# Altium schematic sheet Sheet1.SchDoc
size A; SheetNumber: 1; SheetTotal: 1
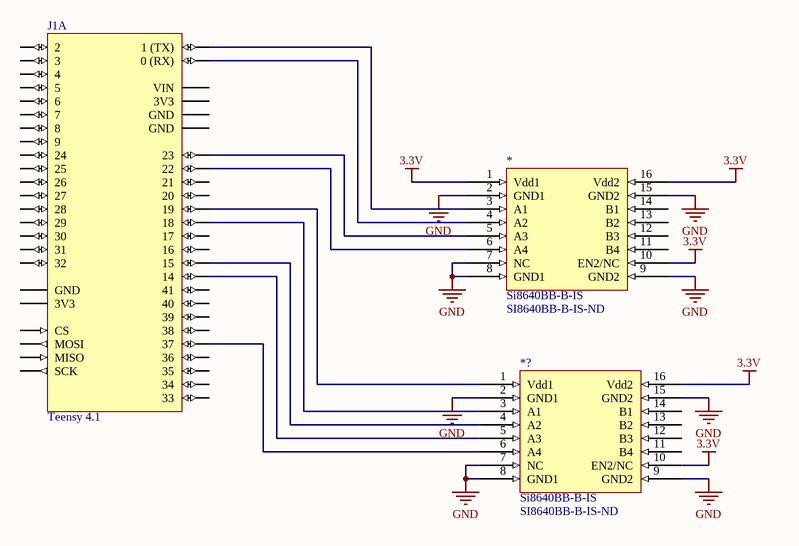
[diagram p0: Sheet1.SchDoc]

## Parts
*  Si8640BB-B-IS  Supplier Part Number 1: SI8640BB-B-IS-ND
*?  Si8640BB-B-IS  Supplier Part Number 1: SI8640BB-B-IS-ND
J1  Teensy 4.1  [Teensy4.1]  (part A of 2)

## Nets
3.3V: *.1(Vdd1) *.10(EN2/NC) *.16(Vdd2) *?.10(EN2/NC) *?.16(Vdd2)
GND: *.2(GND1) *.7(NC) *.8(GND1) *.9(GND2) *.15(GND2) *?.2(GND1) *?.7(NC) *?.8(GND1) *?.9(GND2) *?.15(GND2)
Net*?_1: *?.1(Vdd1) J1.41(19)
Net*?_3: *?.3(A1) J1.40(18)
Net*?_4: *?.4(A2) J1.37(15)
Net*?_5: *?.5(A3) J1.36(14)
Net*?_6: *?.6(A4) J1.29(37)
Net*_3: *.3(A1) J1.3(1_(TX))
Net*_4: *.4(A2) J1.2(0_(RX))
Net*_5: *.5(A3) J1.45(23)
Net*_6: *.6(A4) J1.44(22)

Not connected (* = marked no-connect by the designer): * 11(B4) 12(B3) 13(B2) 14(B1); *? 11(B4) 12(B3) 13(B2) 14(B1); J1 1(GND) 4(2) 5(3) 6(4) 7(5) 8(6) 9(7) 10(8) 11(9) 12(CS) 13(MOSI) 14(MISO) 15(3V3) 16(24) 17(25) 18(26) 19(27) 20(28) 21(29) 22(30) 23(31) 24(32) 25(33) 26(34) 27(35) 28(36) 30(38) 31(39) 32(40) 33(41) 34(GND) 35(SCK) 38(16) 39(17) 42(20) 43(21) 46(3V3) 47(GND) 48(VIN)

## Library data of the parts
* *? = Si8640BB-B-IS: SILICON LABS         SI8640BB-B-IS             Digital Isolator, 4 Channel, 8 ns, 2.5 V, 5.5 V, WSOIC, 16 Pins; Propagation Delay: 13ns; Min Supply Voltage: 2.7V; Max Supply Voltage: 5.5V; Max Power Dissipation: 275mW; Number of Channels: 4; Data Rate: 150Mbps; Isolated Power: No; Pulse Width Distortion (PWD): 4.5ns; Operating Supply Current: 3.6mA; Channel Type: Unidirectional; Max Input Current: 9.2mA; Isolation Voltage: 2.5kV; Rise Time: 4ns; Supplier 1: Digi-Key; Manufacturer: Silicon Labs; Manufacturer Part Number: Si8640BB-B-IS; RoHS: Yes; Category: Integrated Circuits (ICs); Stock 1: 171; Pricing 1: 1=1.84000, 25=1.77440, 100=1.70630, 1000=1.67241 (USD); Mount: Surface Mount; Case/Package: SOIC; Number of Pins: 16; Min Operating Temperature: -40°C; Max Operating Temperature: 125°C; Packaging: Rail/Tube; Package Quantity: 46; Type: General Purpose; Polarity: Unidirectional; Length: 9.9mm; Width: 7.5mm; Depth: 1.25mm; REACH SVHC: Unknown; ComponentLink1URL: https://datasheet.ciiva.com/29659/si864x-29659240.pdf?src-supplier=Digi-Key; ComponentLink1Description: https://datasheet.ciiva.com/29659/si864x-29659240.pdf?src-supplier=Digi-Key
J1 = Teensy4.1